# EAGLE design MPS_Charge_Controller (EAGLE 9.5.0)
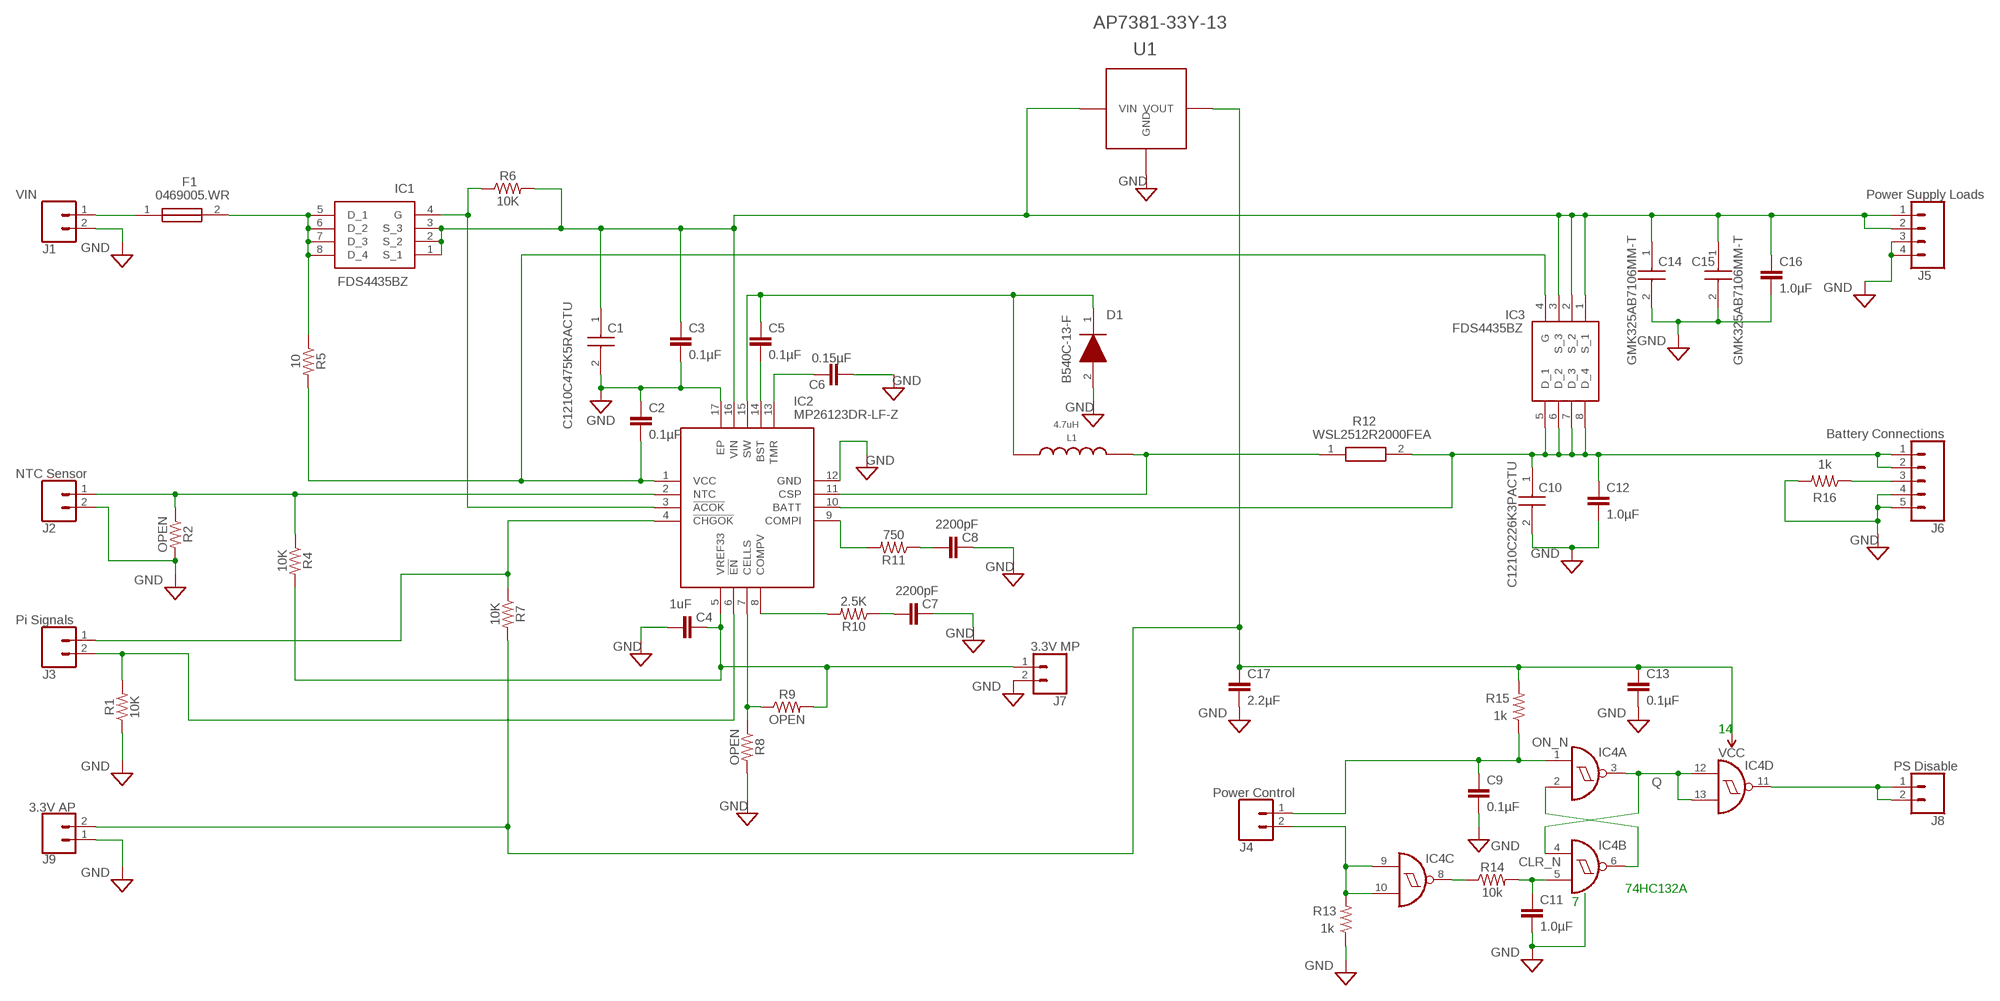
[diagram p0: schematic, sheet 1]

## Parts
C1  C1210C475K5RACTU  [CAPC3225X280N]
C2  0.1µF  0.33UF/330NF-0805-50V-10%  [0805]
C3  0.1µF  0.33UF/330NF-0805-50V-10%  [0805]
C4  1uF  0.33UF/330NF-0805-50V-10%  [0805]
C5  0.1µF  0.33UF/330NF-0805-50V-10%  [0805]
C6  0.15µF  0.33UF/330NF-0805-50V-10%  [0805]
C7  2200pF  0.33UF/330NF-0805-50V-10%  [0805]
C8  2200pF  0.33UF/330NF-0805-50V-10%  [0805]
C9  0.1µF  0.33UF/330NF-0805-50V-10%  [0805]
C10  C1210C226K3PACTU  [CAPC3225X280N]
C11  1.0µF  0.33UF/330NF-0805-50V-10%  [0805]
C12  1.0µF  0.33UF/330NF-0805-50V-10%  [0805]
C13  0.1µF  0.33UF/330NF-0805-50V-10%  [0805]
C14  GMK325AB7106MM-T  [CAPC3225X270N]
C15  GMK325AB7106MM-T  [CAPC3225X270N]
C16  1.0µF  0.33UF/330NF-0805-50V-10%  [0805]
C17  2.2µF  0.33UF/330NF-0805-50V-10%  [0805]
D1  B540C-13-F  [DIOM7959X250N]
F1  0469005.WR  [FUSC3216X105N]
IC1  FDS4435BZ  [SOIC127P600X175-8N]
IC2  MP26123DR-LF-Z  [QFN65P400X400X100-17N]
IC3  FDS4435BZ  [SOIC127P600X175-8N]
IC4  74132D  [SO14]
J1  VIN  CONN_02  [1X02]
J2  NTC Sensor  CONN_02  [1X02]
J3  Pi Signals  CONN_02  [1X02]
J4  Power Control  CONN_02  [1X02]
J5  Power Supply Loads  CONN_04  [1X04]
J6  Battery Connections  CONN_05  [1X05]
J7  3.3V MP  CONN_02  [1X02]
J8  PS Disable  CONN_02  [1X02]
J9  3.3V AP  CONN_02  [1X02]
L1  4.7uH  NRS8030  [NRS8030]
R1  10K  0603_RESISTOR  [0603_RESISTOR]
R2  OPEN  0603_RESISTOR  [0603_RESISTOR]
R4  10K  0603_RESISTOR  [0603_RESISTOR]
R5  10  0603_RESISTOR  [0603_RESISTOR]
R6  10K  0603_RESISTOR  [0603_RESISTOR]
R7  10K  0603_RESISTOR  [0603_RESISTOR]
R8  OPEN  0603_RESISTOR  [0603_RESISTOR]
R9  OPEN  0603_RESISTOR  [0603_RESISTOR]
R10  2.5K  0603_RESISTOR  [0603_RESISTOR]
R11  750  0603_RESISTOR  [0603_RESISTOR]
R12  WSL2512R2000FEA  [RESC6332X71N]
R13  1k  1KOHM-0603-1/10W-1%  [0603]
R14  10k  10KOHM-0603-1/10W-1%  [0603]
R15  1k  1KOHM-0603-1/10W-1%  [0603]
R16  1k  1KOHM-0603-1/10W-1%  [0603]
U1  AP7381-33Y-13  AP7381  [AP7381]

## Nets
BATTERY: C10.1 C12.1 IC2.10(BATT) IC3.5(D_1) IC3.6(D_2) IC3.7(D_3) IC3.8(D_4) J6.1 J6.2 R12.2
BST: C5.2 IC2.14(BST)
CELLS: IC2.7(CELLS) R8.1 R9.1
CHGOK: IC2.4(!CHGOK) J3.1 R7.1
CLR_N: C11.1 IC4.5(B:I1) R14.2
COMPI: IC2.9(COMPI) R11.2
COMPV: IC2.8(COMPV) R10.2
CURRENT_SENSE_P: IC2.11(CSP) L1.P$2 R12.1
DISABLE: IC2.6(!EN) J3.2 R1.2
FUSE_OUT: F1.2 IC1.5(D_1) IC1.6(D_2) IC1.7(D_3) IC1.8(D_4) R5.1
GND: C1.2 C2.1 C3.2 C4.2 C6.2 C7.1 C8.1 C9.2 C10.2 C11.2 C12.2 C13.2 C14.2 C15.2 C16.2 C17.2 D1.2(A) IC2.12(GND) IC2.17(EP) J1.2 J2.2 J5.3 J5.4 J6.4 J6.5 J7.2 J9.1 R1.1 R2.2 R8.2 R13.1 R16.2 U1.P$3(GND) U1.P$4(GND)
INPUT_GATE: IC1.4(G) IC2.3(!ACOK) R6.1
INTERNAL_SW: C5.1 D1.1(K) IC2.15(SW) L1.P$1
MP3V3: C4.1 IC2.5(VREF33) J7.1 R4.2 R9.2
N$4: C8.2 R11.1
N$7: C7.2 R10.1
N$12: F1.1 J1.1
NTC: IC2.2(NTC) J2.1 R2.1 R4.1
ON_N: C9.1 IC4.1(A:I0) J4.1 R15.1
PS_DISABLE: IC4.11(D:O) J8.1 J8.2
Q: IC4.3(A:O) IC4.4(B:I0) IC4.12(D:I0) IC4.13(D:I1)
QBAR: IC4.2(A:I1) IC4.6(B:O)
SYSTEM_PRESENT: J6.3 R16.1
TMR: C6.1 IC2.13(TMR)
TURN_OFF: IC4.9(C:I0) IC4.10(C:I1) J4.2 R13.2
TURN_OFF_N: IC4.8(C:O) R14.1
V3P3: C13.1 C17.1 J9.2 R7.2 R15.2 U1.P$1(VOUT) ; supply symbol labelled VCC
VCC: C2.2 IC2.1(VCC) IC3.4(G) R5.2
VLOAD: C1.1 C3.1 C14.1 C15.1 C16.1 IC1.1(S_1) IC1.2(S_2) IC1.3(S_3) IC2.16(VIN) IC3.1(S_1) IC3.2(S_2) IC3.3(S_3) J5.1 J5.2 R6.2 U1.P$2(VIN)

## Notes on the sheet
- 14
- 74HC132A
- 7

## Power pins joined to a net without a drawn wire
GND: IC4.7(P:GND)
V3P3: IC4.14(P:VCC)

## Library data of the parts
C1 = SamacSys_Parts:C1210C475K5RACTU: Capacitor 1210 4.7uF 50V Kemet 1210 C 4.7uF Ceramic Multilayer Capacitor, 50 V dc, +125C, X7R Dielectric, +/-10% Source: Datasheet <https://componentsearchengine.com/Datasheets/2/C1210C475K5RACTU.pdf>; DESCRIPTION: Capacitor 1210 4.7uF 50V Kemet 1210 C 4.7uF Ceramic Multilayer Capacitor, 50 V dc, +125C, X7R Dielectric, +/-10%; HEIGHT: 2.8mm; MANUFACTURER_NAME: Kemet; MANUFACTURER_PART_NUMBER: C1210C475K5RACTU; MOUSER_PART_NUMBER: 80-C1210C475K5R; MOUSER_PRICE-STOCK: https://www.mouser.co.uk/ProductDetail/KEMET/C1210C475K5RACTU?qs=dB0LedT%252BmmBpncka1nOCUg%3D%3D
C2-C9 C11-C13 C16 C17 = SparkFun-Capacitors:0.33UF/330NF: 0.33µF/330nF ceramic capacitors A capacitor is a passive two-terminal electrical component used to store electrical energy temporarily in an electric field.; PROD_ID: CAP-08469; VALUE: 0.33µF
C10 = SamacSys_Parts:C1210C226K3PACTU: KEMET 1210 (3225M) 22uF Multilayer Ceramic Capacitor MLCC 25V dc +/-10% SMD C1210C226K3PACTU Source: Datasheet; DESCRIPTION: KEMET 1210 (3225M) 22uF Multilayer Ceramic Capacitor MLCC 25V dc +/-10% SMD C1210C226K3PACTU; HEIGHT: 2.8mm; MANUFACTURER_NAME: Kemet; MANUFACTURER_PART_NUMBER: C1210C226K3PACTU; MOUSER_PART_NUMBER: 80-C1210C226K3P; MOUSER_PRICE-STOCK: https://www.mouser.co.uk/ProductDetail/KEMET/C1210C226K3PACTU?qs=lm8WgJiVcEsXoa%2FG19fsAg%3D%3D
C14 C15 = SamacSys_Parts:GMK325AB7106MM-T: Multilayer Ceramic Capacitors MLCC - SMD/SMT 10uF 35V X7R +/-20% 1210 Gen Purp Source: Datasheet <https://componentsearchengine.com/Datasheets/1/GMK325AB7106MM-T.pdf>; DESCRIPTION: Multilayer Ceramic Capacitors MLCC - SMD/SMT 10uF 35V X7R +/-20% 1210 Gen Purp; HEIGHT: 2.7mm; MANUFACTURER_NAME: TAIYO YUDEN; MANUFACTURER_PART_NUMBER: GMK325AB7106MM-T; MOUSER_PART_NUMBER: 963-GMK325AB7106MM-T; MOUSER_PRICE-STOCK: https://www.mouser.com/Search/Refine.aspx?Keyword=963-GMK325AB7106MM-T
D1 = SamacSys_Parts:B540C-13-F: Diodes Inc B540C-13-F, SMT Schottky Diode, 40V 5A, 2-Pin DO-214AB Source: Datasheet <https://componentsearchengine.com/Datasheets/2/B540C-13-F.pdf>; DESCRIPTION: Diodes Inc B540C-13-F, SMT Schottky Diode, 40V 5A, 2-Pin DO-214AB; HEIGHT: 2.5mm; MANUFACTURER_NAME: Diodes Inc.; MANUFACTURER_PART_NUMBER: B540C-13-F; MOUSER_PART_NUMBER: 621-B540C-F; MOUSER_PRICE-STOCK: https://www.mouser.co.uk/ProductDetail/Diodes-Incorporated/B540C-13-F/?qs=v2dnQLbuoRZXHN%2FK4ft5%252Bg%3D%3D
F1 = SamacSys_Parts:0469005.WR: LITTELFUSE - 0469005.WR - FUSE, SMD, 1206, SLOW BLOW, 5A Source: Datasheet <http://www.littelfuse.com/products/fuses/surface-mount-fuses/thin-film-chip-fuses/469/469005.aspx>; DESCRIPTION: LITTELFUSE - 0469005.WR - FUSE, SMD, 1206, SLOW BLOW, 5A; HEIGHT: 1.05mm; MANUFACTURER_NAME: LITTELFUSE; MANUFACTURER_PART_NUMBER: 0469005.WR; MOUSER_PART_NUMBER: 576-0469005.WR; MOUSER_PRICE-STOCK: https://www.mouser.co.uk/ProductDetail/Littelfuse/0469005WR?qs=fp%2Fo%2FcJ74ol%2F%2F%2FgXy9%2FuRQ%3D%3D
IC1 IC3 = SamacSys_Parts:FDS4435BZ: FDS4435BZ, P-channel MOSFET Transistor 8.8 A 30 V, 8-Pin SOIC Source: Datasheet <https://www.googleadservices.com/pagead/aclk?sa=L&ai=DChcSEwiQ1IPVj47sAhUCntUKHY_LCnQYABAAGgJ3cw&ohost=www.google.com&cid=CAASEuRoco0Izs4fMXzZlQAkAisU9g&sig=AOD64_0q9ZSzl9B4LYZShBNrwAYTvmkutA&q&adurl&ved=2ahUKEwiH6_zUj47sAhXlx4UKHYGNAW8Q0Qx6BAgGEAE>; DESCRIPTION: FDS4435BZ, P-channel MOSFET Transistor 8.8 A 30 V, 8-Pin SOIC; HEIGHT: 1.75mm; MANUFACTURER_NAME: ON Semiconductor; MANUFACTURER_PART_NUMBER: FDS4435BZ; MOUSER_PART_NUMBER: 512-FDS4435BZ; MOUSER_PRICE-STOCK: https://www.mouser.co.uk/ProductDetail/ON-Semiconductor-Fairchild/FDS4435BZ?qs=GXuM9q1TrDl7P7R1rhmrgw%3D%3D
IC2 = SamacSys_Parts:MP26123DR-LF-Z: Battery Management 2A 24Vin 2-3 Cell Switching Charger Source: Datasheet <https://www.monolithicpower.com/pub/media/document/MP26123_r1.01.pdf>; DESCRIPTION: Battery Management 2A 24Vin 2-3 Cell Switching Charger; HEIGHT: 1mm; MANUFACTURER_NAME: Monolithic Power Systems (MPS); MANUFACTURER_PART_NUMBER: MP26123DR-LF-Z; MOUSER_PART_NUMBER: 946-MP26123DRLFZ; MOUSER_PRICE-STOCK: https://www.mouser.co.uk/ProductDetail/Monolithic-Power-Systems-MPS/MP26123DR-LF-Z?qs=ddTkeYFZflVgOJRHHyrLxQ%3D%3D
IC4 = 74xx-us:74*132: Quad 2-input NAND schmitt trigger
J1-J4 J7-J9 = SparkFun-Connectors:CONN_02: Multi connection point. Often used as Generic Header-pin footprint for 0.1 inch spaced/style header connections On any of the 0.1 inch spaced packages, you can populate with these: Break Away Headers - Straight <https://www.sparkfun.com/products/116> (PRT-00116) Break Away Male Headers - Right Angle <https://www.sparkfun.com/products/553> (PRT-00553) Female Headers <https://www.sparkfun.com/products/115> (PRT-00115) Break Away Headers - Machine Pin <https://www.sparkfun.com/products/117> (PRT-00117) Break Away Female Headers - Swiss Machine Pin <https://www.sparkfun.com/products/743> (PRT-00743) For SCREWTERMINALS and SPRING TERMINALS visit here: Screw Terimnals on SparkFun.com <https://www.sparkfun.com/search/results?term=Screw+Terminals> (5mm/3.5mm/2.54mm spacing) This device is also useful as a general connection point to wire up your design to another part of your project. Our various solder wires solder well into these plated through hole pads. Hook-Up Wire - Assortment (Stranded, 22 AWG) <https://www.sparkfun.com/products/11375> (PRT-11375) Hook-Up Wire - Assortment (Solid Core, 22 AWG) <https://www.sparkfun.com/products/11367> (PRT-11367) View the entire wire category on our website here <https://www.sparkfun.com/categories/141> Special notes: Molex polarized connector foot print use with: PRT-08233 with associated crimp pins and housings. 2.54_SCREWTERM for use with PRT-10571. 3.5mm Screw Terminal footprints for PRT-08084 5mm Screw Terminal footprints for use with PRT-08432
J5 = SparkFun-Connectors:CONN_04: Multi connection point. Often used as Generic Header-pin footprint for 0.1 inch spaced/style header connections On any of the 0.1 inch spaced packages, you can populate with these: Break Away Headers - Straight <https://www.sparkfun.com/products/116> (PRT-00116) Break Away Male Headers - Right Angle <https://www.sparkfun.com/products/553> (PRT-00553) Female Headers <https://www.sparkfun.com/products/115> (PRT-00115) Break Away Headers - Machine Pin <https://www.sparkfun.com/products/117> (PRT-00117) Break Away Female Headers - Swiss Machine Pin <https://www.sparkfun.com/products/743> (PRT-00743) For SCREWTERMINALS and SPRING TERMINALS visit here: Screw Terimnals on SparkFun.com <https://www.sparkfun.com/search/results?term=Screw+Terminals> (5mm/3.5mm/2.54mm spacing) This device is also useful as a general connection point to wire up your design to another part of your project. Our various solder wires solder well into these plated through hole pads. Hook-Up Wire - Assortment (Stranded, 22 AWG) <https://www.sparkfun.com/products/11375> (PRT-11375) Hook-Up Wire - Assortment (Solid Core, 22 AWG) <https://www.sparkfun.com/products/11367> (PRT-11367) View the entire wire category on our website here <https://www.sparkfun.com/categories/141> Special notes: Molex polarized connector foot print use with SKU : PRT-08231 with associated crimp pins and housings. 1MM SMD Version SKU: PRT-10208; PROD_ID: CONN-09696
J6 = SparkFun-Connectors:CONN_05: Multi connection point. Often used as Generic Header-pin footprint for 0.1 inch spaced/style header connections On any of the 0.1 inch spaced packages, you can populate with these: Break Away Headers - Straight <https://www.sparkfun.com/products/116> (PRT-00116) Break Away Male Headers - Right Angle <https://www.sparkfun.com/products/553> (PRT-00553) Female Headers <https://www.sparkfun.com/products/115> (PRT-00115) Break Away Headers - Machine Pin <https://www.sparkfun.com/products/117> (PRT-00117) Break Away Female Headers - Swiss Machine Pin <https://www.sparkfun.com/products/743> (PRT-00743) For SCREWTERMINALS and SPRING TERMINALS visit here: Screw Terimnals on SparkFun.com <https://www.sparkfun.com/search/results?term=Screw+Terminals> (5mm/3.5mm/2.54mm spacing) This device is also useful as a general connection point to wire up your design to another part of your project. Our various solder wires solder well into these plated through hole pads. Hook-Up Wire - Assortment (Stranded, 22 AWG) <https://www.sparkfun.com/products/11375> (PRT-11375) Hook-Up Wire - Assortment (Solid Core, 22 AWG) <https://www.sparkfun.com/products/11367> (PRT-11367) View the entire wire category on our website here <https://www.sparkfun.com/categories/141> Special notes: Molex polarized connector foot print use with SKU : PRT-08231 with associated crimp pins and housings. 1MM SMD Version SKU: PRT-10208
L1 = DR73_NRS8030T:NRS8030
R1 R2 R4-R11 = 0603_RESISTOR:0603_RESISTOR
R12 = SamacSys_Parts:WSL2512R2000FEA: RESISTOR, 2512 0.2 Ohm +/- 1.0 % 1 W Source: Datasheet <https://componentsearchengine.com/Datasheets/1/WSL2512R2000FEA.pdf>; DESCRIPTION: RESISTOR, 2512 0.2 Ohm +/- 1.0 % 1 W; HEIGHT: mm; MANUFACTURER_NAME: Vishay; MANUFACTURER_PART_NUMBER: WSL2512R2000FEA; MOUSER_PART_NUMBER: 71-WSL2512R2000FEA; MOUSER_PRICE-STOCK: https://www.mouser.com/Search/Refine.aspx?Keyword=71-WSL2512R2000FEA
R13 R15 R16 = SparkFun-Resistors:1KOHM: 1kΩ resistor A resistor is a passive two-terminal electrical component that implements electrical resistance as a circuit element. Resistors act to reduce current flow, and, at the same time, act to lower voltage levels within circuits. - Wikipedia; PROD_ID: RES-07856
R14 = SparkFun-Resistors:10KOHM: 10kΩ resistor A resistor is a passive two-terminal electrical component that implements electrical resistance as a circuit element. Resistors act to reduce current flow, and, at the same time, act to lower voltage levels within circuits. - Wikipedia; PROD_ID: RES-00824
U1 = AP7381:AP7381

## Board
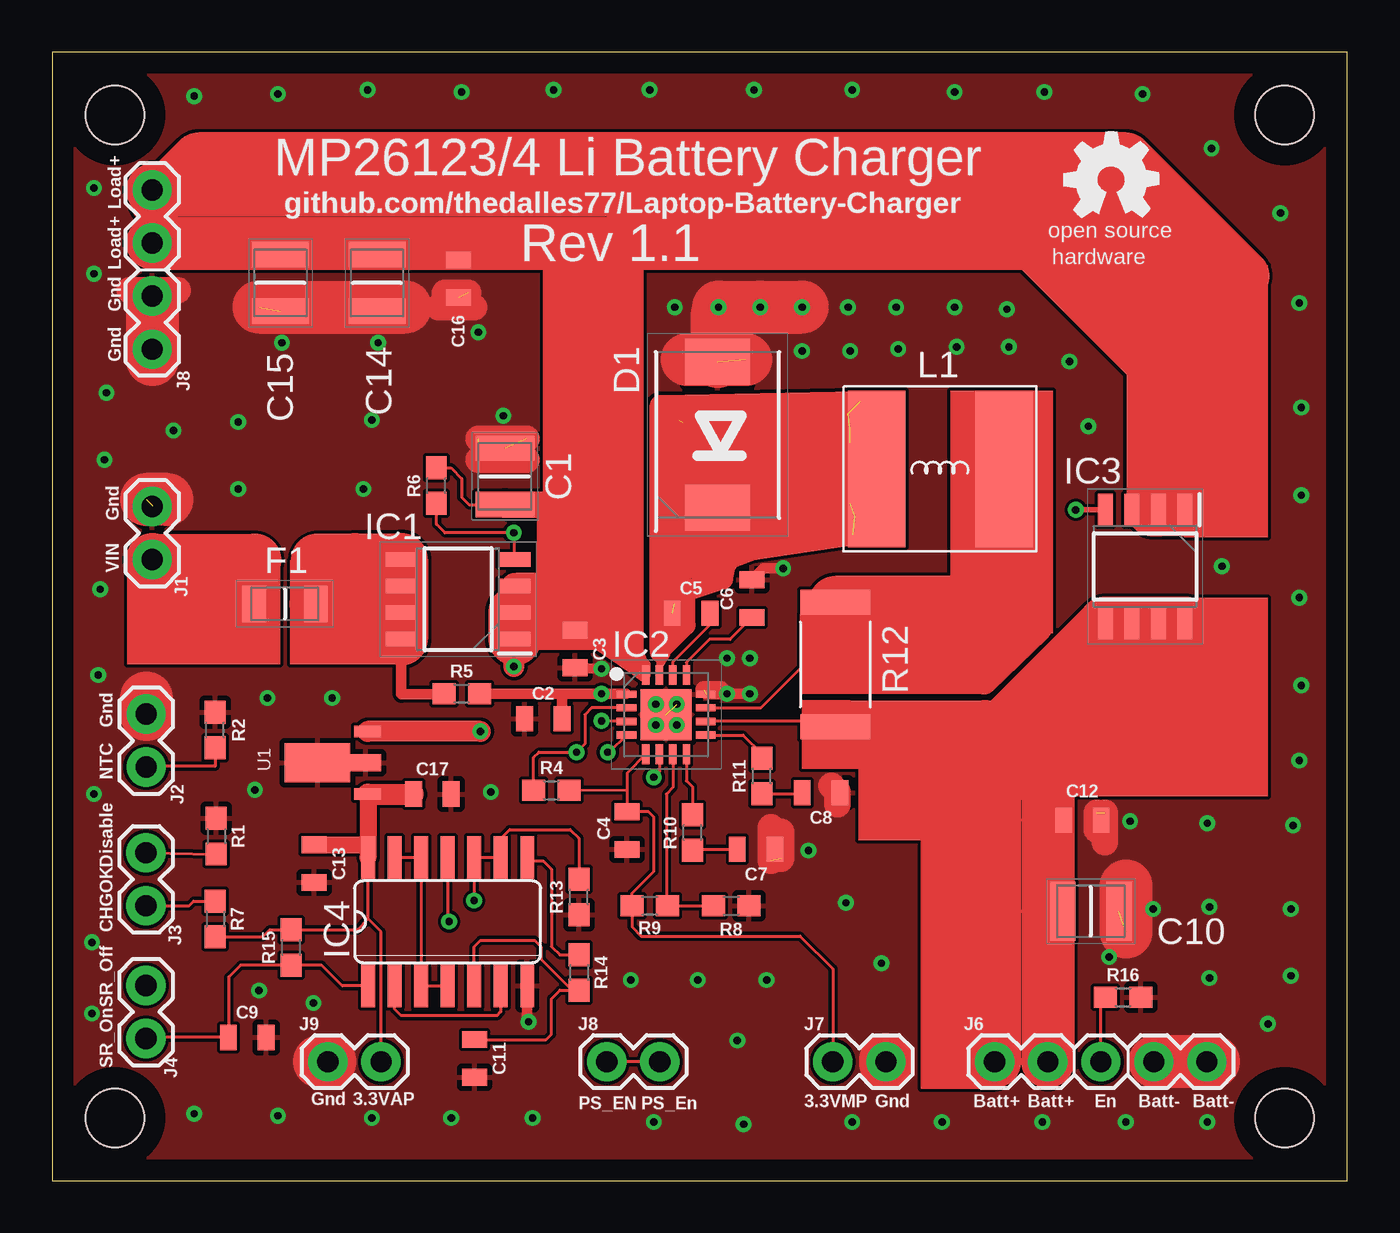
[diagram p1: board, top side]
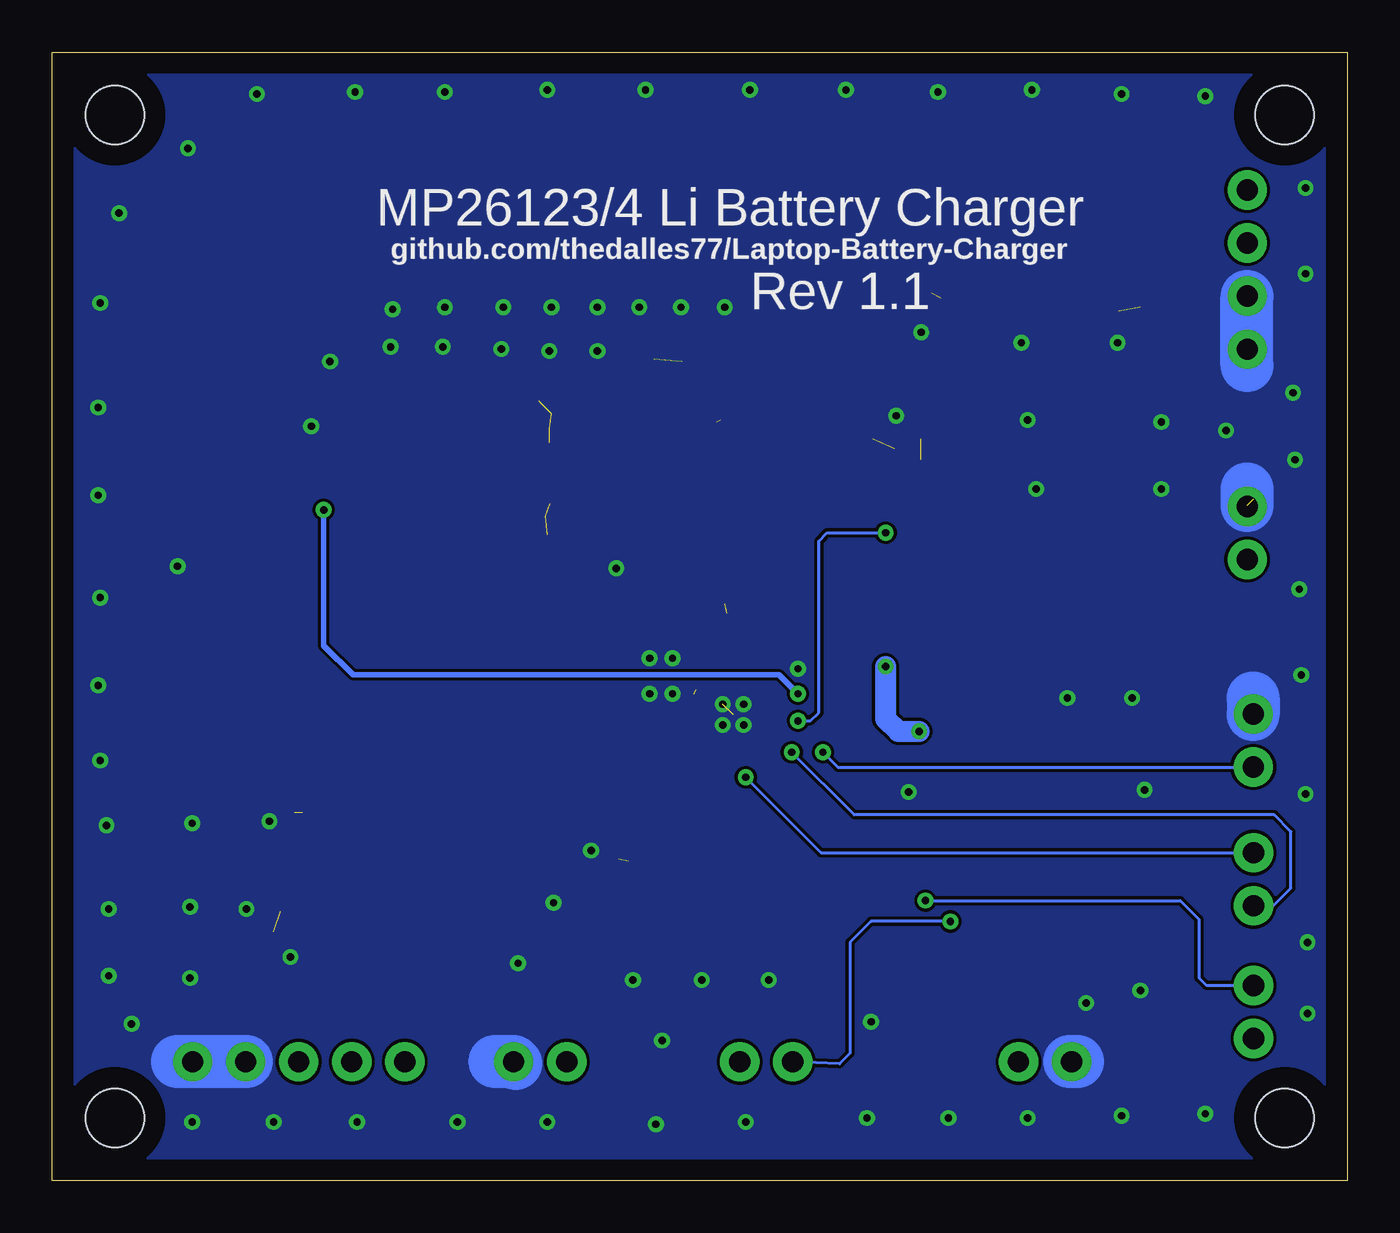
[diagram p2: board, bottom side, seen from below]

Size 62 x 54 mm. Coordinates in mm from the lower left corner, seen from the top.
Outline: 0,0 62,0 62,54 0,54 0,0
Copper layers (1*16): Top 0.035mm / dielectric 1.5mm / Bottom 0.035mm
Design rules "default": minimum track width 6mil, minimum drill 0.35mm, track to track 6mil, track to pad 6mil, pad to pad 6mil, via to via 6mil, smd to smd 6mil, copper to edge 40mil, drill to drill 6mil, minimum pad ring 10mil, minimum via ring 8mil, stop-mask expansion 4mil, vias tented up to drill 0mil, thermal gap 10mil
Holes 2.8 mm at 3,3 59,3 59,51 3,51

### Footprints (pad centres in the part's own frame; a part is rotated, then mirrored left to right if it is on the bottom)
CAPC3225X280N = smd 1.21 x 2.82: 1 -1.35,0; 2 1.35,0
0805 = smd 0.8 x 1.2: 1 -0.9,0; 2 0.9,0
CAPC3225X270N = smd 1.22 x 2.72: 1 -1.35,0; 2 1.35,0
DIOM7959X250N = smd 2.2 x 3.1: 1 -3.5,0; 2 3.5,0
FUSC3216X105N = smd 1.14 x 1.75: 1 -1.48,0; 2 1.48,0
SOIC127P600X175-8N = smd 1.525 x 0.7: 1 -2.712,1.905; 2 -2.712,0.635; 3 -2.712,-0.635; 4 -2.712,-1.905; 5 2.712,-1.905; 6 2.712,-0.635; 7 2.712,0.635; 8 2.712,1.905
QFN65P400X400X100-17N = smd 0.95 x 0.35: 1 -1.9,0.975; 2 -1.9,0.325; 3 -1.9,-0.325; 4 -1.9,-0.975; 9 1.9,-0.975; 10 1.9,-0.325; 11 1.9,0.325; 12 1.9,0.975 | smd 0.35 x 0.95: 5 -0.975,-1.9; 6 -0.325,-1.9; 7 0.325,-1.9; 8 0.975,-1.9; 13 0.975,1.9; 14 0.325,1.9; 15 -0.325,1.9; 16 -0.975,1.9 | smd 2.45 x 2.45: 17 0,0
SO14 = smd 0.66 x 2.032: 1 -3.81,-3.073; 2 -2.54,-3.073; 3 -1.27,-3.073; 4 0,-3.073; 5 1.27,-3.073; 6 2.54,-3.073; 7 3.81,-3.073; 8 3.81,3.073; 9 2.54,3.073; 10 1.27,3.073; 11 0,3.073; 12 -1.27,3.073; 13 -2.54,3.073; 14 -3.81,3.073
1X02 = drill 1.016 pad 1.88: 1 0,0; 2 2.54,0
1X04 = drill 1.016 pad 1.88: 1 0,0; 2 2.54,0; 3 5.08,0; 4 7.62,0
1X05 = drill 1.016 pad 1.88: 1 0,0; 2 2.54,0; 3 5.08,0; 4 7.62,0; 5 10.16,0
NRS8030 = smd 2.75 x 7.5: P$1 -3.05,0; P$2 3.05,0
0603_RESISTOR = smd 1.1 x 1: 1 -0.85,0; 2 0.85,0
RESC6332X71N = smd 1.194 x 3.353: 1 -2.972,0; 2 2.972,0
0603 = smd 1.1 x 1: 1 -0.85,0; 2 0.85,0
AP7381 = smd 0.55 x 1.3: P$1 -1.5,0; P$2 1.5,0 | smd 0.8 x 1.475: P$3 0,0.1 | smd 1.85 x 3.125: P$4 0,2.4

### Placement (x,y rotation side)
C1  21.67,33.7 90 top
C2  23.51,22.11 0 top
C3  25.02,25.44 270 top
C4  27.52,16.75 270 top
C5  30.59,27.15 0 top
C6  33.5,27.85 90 top
C7  33.7,15.85 180 top
C8  36.81,18.56 180 top
C9  9.34,6.85 0 top
C10  49.72,12.89 0 top
C11  20.22,5.85 270 top
C12  49.32,17.24 0 top
C13  12.54,15.17 270 top
C14  15.55,42.96 270 top
C15  10.93,42.96 270 top
C16  19.45,43.16 270 top
C17  18.2,18.5 0 top
D1  31.85,35.69 90 top
F1  11.14,27.6 0 top
IC1  19.43,27.82 180 top
IC2  29.39,22.3 0 top
IC3  52.32,29.39 270 top
IC4  18.93,12.39 0 top
J1  4.79,29.72 90 top
J2  4.5,19.79 90 top
J3  4.49,13.15 90 top
J4  4.49,6.8 90 top
J5  4.79,47.41 270 top
J6  45.12,5.69 0 top
J7  37.37,5.69 0 top
J8  26.55,5.69 0 top
J9  13.2,5.69 0 top
L1  42.52,34.06 0 top
R1  7.85,16.48 270 top
R2  7.8,21.57 90 top
R4  23.9,18.68 0 top
R5  19.6,23.3 0 top
R6  18.39,33.26 90 top
R7  7.81,12.52 270 top
R8  32.5,13.15 0 top
R9  28.61,13.15 180 top
R10  30.66,16.65 90 top
R11  33.97,19.36 90 top
R12  37.49,24.7 270 top
R13  25.22,13.57 90 top
R14  25.22,9.96 270 top
R15  11.44,11.16 90 top
R16  51.27,8.77 0 top
U1  15.1,20 90 top
U$1  [OSHW_5MM]  50.7,47.9 0 top

### Tracks (layer width: path | path; a pad name or v marks a point on that pad's centre or on a via)
BATTERY
  Top 0.152: IC2.10 31.32,22 37.76,22 | C10.1 46.59,12.89 46.5,12.8 45.12,14.18 45.12,18 45.88,17.24 C12.1
  Top 0.305: 37.76,22 R12.2
  Top 2.54: R12.2 44.67,21.73 45.12,21.28 | J6.2 47.66,18.74 45.12,21.28 | J6.1 45.12,18 45.12,21.28 | IC3.8 IC3.7 IC3.6 IC3.5 45.12,21.38 45.12,21.28
BST
  Top 0.152: IC2.14 29.71,24.79 29.7,24.8 31.49,26.59 C5.2
CELLS
  Top 0.152: IC2.7 29.71,18.82 29.4,18.5 29.4,13.21 R9.1 R8.1
CHGOK  (via drill 0.35)
  Top 0.152: IC2.4 26.66,20.5 v26.6,20.5 | J3.1 6.55,13.15 6.77,13.37 R7.1
  Bottom 0.152: J3.1 3.55,13.15 2.7,14 2.7,16.7 3.5,17.5 23.6,17.5 v26.6,20.5
CLR_N
  Top 0.152: C11.1 23.65,6.75 23.9,7 23.9,8.7 24.31,9.11 R14.2 24.89,9.11 23.4,10.6 23.4,11.2 23.1,11.5 20.5,11.5 20.2,11.2 IC4.5
COMPI
  Top 0.152: IC2.9 33.08,21.32 33.97,20.43
  Top 0.305: R11.2 33.97,20.43
COMPV
  Top 0.152: IC2.8 30.36,19.14 30.66,18.84 R10.2
CURRENT_SENSE_P
  Top 0.152: IC2.11 33.92,22.62 37.5,26.2 R12.1 | 39.3,26.6 38.23,27.67 R12.1
  Top 0.305: R12.1
  Top 2.54: L1.P$2 45.57,28.97 44.27,27.67 R12.1
DISABLE  (via drill 0.35)
  Top 0.152: IC2.6 29.07,19.57 v28.8,19.3 | J3.2 R1.2
  Bottom 0.152: v28.8,19.3 25.19,15.69 J3.2
FUSE_OUT
  Top 0.508: IC1.8 16.7,25.9 16.7,23.3 16.73,23.27 18.73,23.27 R5.1
  Top 2.54: F1.2 14.5,29.72 IC1.5 IC1.6 IC1.7 IC1.8
GND  (via drill 0.35)  (11 unrouted)
  Top 0.152: 31.9,41.6 v31.9,41.8 | J5.3 3.7,42.6
  Top 0.508: C3.2 v26.3,24.5 | v35,29.3 34.05,29.3 C6.2 | IC2.12 32.27,23.27 v32.3,23.3 v33.4,23.3 | IC4.7 22.74,7.66 v22.8,7.6
  Top 0.813: 32,23.5 31.2,23.5
  Top 1.27: 20.4,34.5 22.7,34.5 | 20.4,35.5 22.7,35.5 | 37.6,18 37.6,18.6 37.3,18.9 | 34.9,16.7 34.9,15.4 | 34.4,16.9 34.4,15.3 | 50,17.6 50,16.8 | 50.4,16.2 50.4,17.6 | 18.8,42.5 19.9,42.5 | 18.5,41.8 20.2,41.8 | 3.7,42.6 6,42.6
  Top 2.54: D1.2 31.85,41.55 31.9,41.6 | v33.9,41.8 v31.9,41.8 v35.9,41.8 | 5.5,32.6 4.5,32.6 | 52.8,5.7 55.6,5.7 | 30.4,39.3 33.2,39.3 | 4.8,39.3 4.8,41.9 | 51.4,14.1 51.4,11.9 | 9.9,41.8 16.9,41.8 | 13.3,5.7 12.8,5.7 | 4.5,22.3 4.5,23.1 | 39.9,5.8 39.9,5.6
  Bottom 2.54: 4.8,39 4.8,42.3 | 4.8,33.1 4.8,32.3 | 4.5,23.1 4.5,22.3 | 40.8,5.7 J7.2 39.8,5.6 | 56,5.7 52.7,5.7 | 13.3,5.7 12.9,5.7
  other vias: 12.5,8.5 27.7,9.6 30.9,9.6 38,13.3 51.6,17.2 52.7,13 59.7,20.1 59.7,27.9 59.8,37 58.8,46.3 52.2,52 43.2,52.1 33.6,52.2 24,52.2 15.1,52.2 6.8,51.9 21.6,36.6 20.4,40.6 15.6,40.1 11,40.1 14.9,33.1 40.4,41.8 43.2,41.8 45.8,39.9 49.6,36.1 59.3,13 28.9,22.8 28.9,21.8 29.9,21.8 29.9,22.8 32.3,25 33.4,25 8.9,36.3 15.3,36.4 8.9,33.1 2.6,37.7 55.4,13.1 55.3,17.1 59.4,17 50.6,10.7 55.4,9.7 59.3,9.8 59.8,23.7 32.8,6.7 33.1,2.7 42.6,2.8 51.4,2.8 23,3 36.2,15.8 39.7,10.4 58.2,7.5 47.4,2.8 38.3,2.8 28.8,2.8 19.1,3 1.9,8 1.9,11.4 2,18.5 2.2,24.2 2.3,28.3 2.5,34.5 5.8,35.9 2,43.4 2,47.5 10.8,52 19.6,52.1 28.6,52.2 38.3,52.2 47.5,52.1 55.5,49.4 59.7,42 59.8,32.8 55.3,2.8 35.9,39.7 29.8,41.8 38.2,39.7 38.1,41.8 40.5,39.8 43.3,39.9 45.7,41.7 48.7,39.2 34.2,9.6 9.9,9.1 56,29.4 10.3,23.1 13.4,23.1 9.7,18.7 21,18.6 15.3,3 10.8,3.1 6.8,3.2
  pour Top: 0,54 62,54 62,0 0,0
  pour Bottom: 0,0 0,54 62,54 62,0
INPUT_GATE  (via drill 0.35)
  Top 0.152: v26.3,22 27.46,22 IC2.3 | R6.1 18.39,31.41 18.8,31 v22.1,31 22.14,30.96 IC1.4
  Bottom 0.152: v26.3,22 25.7,22 25.3,22.4 25.3,30.6 24.9,31 v22.1,31
INTERNAL_SW  (7 unrouted)
  Top 0.152: 29.07,24.4 IC2.15 29.1,24.6 | 29.1,25.3 29.69,25.89 C5.1 31.84,32.06
  Top 0.254: 29.1,24.6 29.4,25.1
  Top 0.305: 29.07,24.4 29.07,25.27 29.1,25.3
  Top 1.016: 29.1,25.4 29.1,25.3 | 29.1,25.4 30.3,26.6 30.3,28.2 32.1,28.8 32.2,29.4 32.5,29.8 33.5,30.2 38.3,30.9 | 29.1,25.4 29.1,37.1 38.7,37.3 | 30.2,36.3 35.3,36.7 | 30.2,35.3 38.1,36.7 | 30.1,34.4 38.2,36 | 30.1,33.4 38.2,35.3 | 30.2,31 38.2,32.4 | 30,30.2 38.4,31.8 | 29.8,27.6 30,36.4
  Top 2.54: 31.84,32.06 D1.1 32.53,32.51 L1.P$1
MP3V3
  Top 0.152: IC2.5 27.52,19.5 27.52,18.7 | 27.52,18.7 C4.1 28.55,17.65 28.8,17.4 28.8,14.8 27.76,13.76 R9.2 27.76,12.14 28.2,11.7 35.8,11.7 37.37,10.13 J7.1 | R4.2 27.52,18.7
N$1
  Top 1.27: 47.2,26.4 44.6,23.9
N$3
  Top 2.54: 4.9,45 5,44.9
N$4
  Top 0.152: R11.1 35.86,18.51 C8.2
N$5
  Top 1.016: 30.1,29.2 32.4,29.8
N$7
  Top 0.152: 30.71,15.85 C7.2
  Top 0.305: R10.1 30.71,15.85
N$12
  Top 2.54: J1.1 F1.1
N$14
  Top 2.54: 4.8,29.7 9.7,29.7
N$15
  Top 2.54: 16.6,29.7 12.7,29.7
NTC  (via drill 0.35)
  Top 0.152: J2.1 4.54,19.82 7.8,19.82 R2.1 | IC2.2 25.82,22.62 25.5,22.3 25.5,20.9 v25.1,20.5 23.3,20.5 23.05,20.25 R4.1
  Bottom 0.152: v25.1,20.5 24.39,19.79 J2.1
ON_N
  Top 0.152: IC4.1 13.88,9.32 12.89,10.31 R15.1 9.01,10.31 8.44,9.74 C9.1 4.54,6.85 J4.1
PS_DISABLE  (via drill 0.35)
  Top 0.152: J8.2 J8.1 | IC4.11 18.93,12.47 v19,12.4
  Bottom 0.152: v19,12.4 22.8,12.4 23.8,11.4 23.8,6.1 24.31,5.59 J8.1
Q
  Top 0.152: IC4.13 IC4.12 IC4.3 IC4.4
QBAR
  Top 0.152: IC4.6 21.47,8.07 21.3,7.9 16.7,7.9 16.39,8.21 IC4.2
SYSTEM_PRESENT
  Top 0.152: J6.3 50.2,8.55 R16.1
TMR
  Top 0.152: IC2.13 30.36,24.8 31.46,25.9 32.45,25.9 C6.1
TURN_OFF  (via drill 0.35)
  Top 0.152: R13.2 25.22,16.38 24.8,16.8 21.9,16.8 21.47,16.37 IC4.9 IC4.10 v20.2,13.4
  Bottom 0.152: v20.2,13.4 8,13.4 7.1,12.5 7.1,9.7 6.74,9.34 J4.2
TURN_OFF_N
  Top 0.152: IC4.8 22.9,15.3 23.5,15.3 23.9,14.9 23.9,11.2 24.3,10.8 R14.1
V3P3
  Top 0.152: 15.12,12.52 IC4.14 | 15.12,12.52 14.61,12.01 R15.2 10.41,12.01 10.07,11.67 R7.2 | J9.2 15.74,11.9 15.12,12.52
  Top 0.813: U1.P$1 15.12,18.48 15.12,16.1 | 15.12,16.1 IC4.14 | C13.1 15.09,16.07 15.12,16.1
  Top 1.016: U1.P$1 C17.1
VCC  (via drill 0.35)
  Top 0.254: IC3.4 v49,32.1 | 27.46,23.3 IC2.1
  Top 0.508: 27.46,23.3 v26.3,23.3 24.4,23.3 | 24.4,23.3 R5.2 | C2.2 24.41,23.29 24.4,23.3
  Bottom 0.254: v49,32.1 49,25.6 47.6,24.2 27.2,24.2 v26.3,23.3
VLOAD  (via drill 0.35)
  Top 0.152: R6.2 19.09,34.11 19.6,33.6 19.6,32.7 19.95,32.35 C1.1 | IC3.2 52.7,32.1 IC3.3 | IC3.1 54.23,40.77 54.33,40.88 | C16.1 15.8,44.06 C14.1 C15.1 10.37,44.87 J5.2 | J5.1 5,47.36 5,46.9 | 28.1,24.6 IC2.16 28.4,23.9
  Top 0.254: 28.4,23.9 27.3,24.7
  Top 0.508: IC2.16 28.41,24.69 28.19,24.92 28.19,25 27.7,25.4
  Top 1.016: 22.45,28.15 IC1.3 | 27.7,25.4 26.8,25.8 | 26,26.1 26,27.8 | 26,26 28.1,24.6 | v22.1,24.6 22.1,25.87 IC1.1 | v20.5,21.5 U1.P$2
  Top 1.27: IC1.3 IC1.2 | 26.8,25.8 26,26.1 C3.1 22.45,28.15 | C1.1 26,32.35 26,32.3
  Top 2.54: IC1.2 IC1.1 | 26,27.8 26,32.3 26,43.8 27.4,45.2 50,45.2 54.33,40.88 | IC3.2 IC3.1 54.3,32.18 54.3,43 49.89,47.41 J5.1 | J5.2 46.93,44.87 52.7,39.1 52.7,32.1 | 57,43.3 51.4,48.9 7,48.9 5,46.9
  Bottom 1.016: v22.1,24.6 22.1,22.1 21.5,21.5 v20.5,21.5
(copper drawn outside any net)
  shapes: Top area x23

### Text on the board
tPlace: MP26123/4 Li Battery Charger | Load+ | github.com/thedalles77/Laptop-Battery-Charger | Load+ | Rev 1.1 | Gnd | Gnd | J8 | Gnd | VIN | Gnd | NTC | Disable | CHGOK | SR_Off | SR_On | Gnd | 3.3VAP | 3.3VMP | Gnd | Batt+ | Batt+ | En | Batt- | Batt- | PS_EN | PS_En
bPlace: MP26123/4 Li Battery Charger | github.com/thedalles77/Laptop-Battery-Charger | Rev 1.1